# Altium schematic sheet coolaz-sheet.schdoc
size 212 x 144 mm
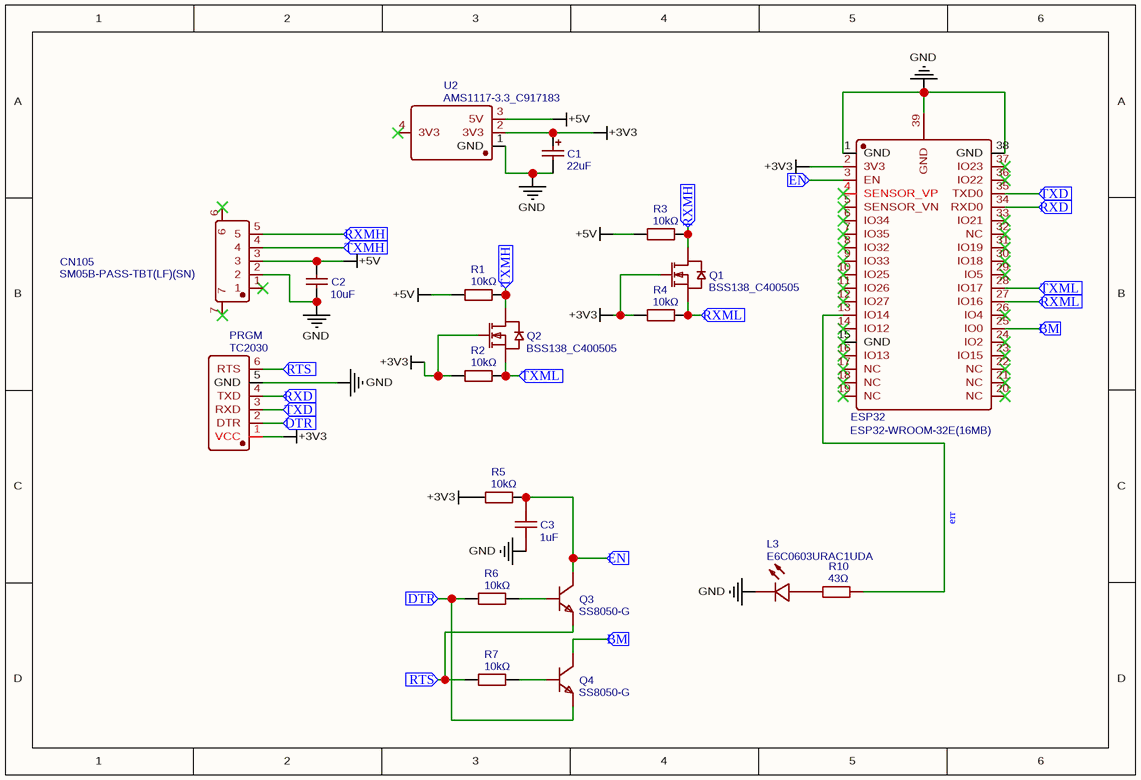
[diagram p0: coolaz-sheet.schdoc]

## Parts
C1  22uF  [CAP-SMD_L3.5-W2.8-R-RD]
C2  10uF  [C0402]
C3  1uF  [C0402]
CN105  SM05B-PASS-TBT(LF)(SN)  [CONN-SMD_5P-P2.00_SM05B-PASS-TBT-LF-SN]
ESP32  ESP32-WROOM-32E(16MB)  [WIFI-SMD_ESP32-WROOM-32E]
L3  E6C0603URAC1UDA  [LED0603-R-RD]
PRGM  TC2030  [TAG-CONNECT_TC2030-IDC-FP]
Q1  BSS138_C400505  [SOT-23-3_L2.9-W1.3-P1.90-LS2.4-BR]
Q2  BSS138_C400505  [SOT-23-3_L2.9-W1.3-P1.90-LS2.4-BR]
Q3  SS8050-G  [SOT-23-3_L2.9-W1.6-P1.90-LS2.8-BR]
Q4  SS8050-G  [SOT-23-3_L2.9-W1.6-P1.90-LS2.8-BR]
R1  10kΩ  [R0603]
R2  10kΩ  [R0603]
R3  10kΩ  [R0603]
R4  10kΩ  [R0603]
R5  10kΩ  [R0603]
R6  10kΩ  [R0603]
R7  10kΩ  [R0603]
R10  43Ω  [R0402]
U2  AMS1117-3.3_C917183  [SOT-223-3_L6.7-W3.7-P2.30-LS7.0-BR]

## Ports
BM (in), DTR (in), EN (in), RTS (in), RXD (in), RXMH (in), RXML (in), TXD (in), TXMH (in), TXML (in)

## Nets
+3V3: C1.1 ESP32.2(3V3) PRGM.1(VCC) Q1.1(G) Q2.1(G) R2.1 R4.1 R5.1 U2.2(3V3)
+5V: C2.2 CN105.3 R1.1 R3.1 U2.3(5V)
GND: C1.2 C2.1 C3.1 CN105.2 ESP32.1(GND) ESP32.38(GND) ESP32.39(GND) L3.2(-) PRGM.5(GND) U2.1(GND)
BM: ESP32.25(IO0) Q4.3(C) ; port BM
DTR: PRGM.2(DTR) Q4.2(E) R6.1 ; port DTR
EN: C3.2 ESP32.3(EN) Q3.3(C) R5.2 ; port EN
err: ESP32.13(IO14) R10.2
RTS: PRGM.6(RTS) Q3.2(E) R7.1 ; port RTS
RXD: ESP32.34(RXD0) PRGM.4(TXD) ; port RXD
RXMH: CN105.5 Q1.3(D) R3.2 ; port RXMH
RXML: ESP32.27(IO16) Q1.2(S) R4.2 ; port RXML
TXD: ESP32.35(TXD0) PRGM.3(RXD) ; port TXD
TXMH: CN105.4 Q2.3(D) R1.2 ; port TXMH
TXML: ESP32.28(IO17) Q2.2(S) R2.2 ; port TXML
NetL3_1: L3.1(+) R10.1
NetQ3_1: Q3.1(B) R6.2
NetQ4_1: Q4.1(B) R7.2

Not connected (* = marked no-connect by the designer): CN105 1* 6* 7*; ESP32 4(SENSOR_VP)* 5(SENSOR_VN)* 6(IO34)* 7(IO35)* 8(IO32)* 9(IO33)* 10(IO25)* 11(IO26)* 12(IO27)* 14(IO12)* 15(GND)* 16(IO13)* 17(NC)* 18(NC)* 19(NC)* 20(NC)* 21(NC)* 22(NC)* 23(IO15)* 24(IO2)* 26(IO4)* 29(IO5)* 30(IO18)* 31(IO19)* 32(NC)* 33(IO21)* 36(IO22)* 37(IO23)*; U2 4(3V3)*

## Library data of the parts
C1 = 22uF: BOM_Manufacturer: CEC; BOM_Manufacturer Part: CA45-B-16V-22UF-K; nameAlias: Capacitance; BOM_Supplier: LCSC; BOM_Supplier Part: C129568; BOM_JLCPCB Part Class: Extended Part; spicePre: C; spiceSymbolName: CA45-B-16V-22UF-K
C2 = 10uF: BOM_Manufacturer Part: CL05A106MQ5NUNC; BOM_Manufacturer: SAMSUNG; nameAlias: Capacitance; BOM_Supplier: LCSC; BOM_Supplier Part: C15525; BOM_JLCPCB Part Class: Basic Part; spicePre: C; spiceSymbolName: CL05A106MQ5NUNC
C3 = 1uF: BOM_Manufacturer: SAMSUNG; BOM_Manufacturer Part: CL05A105KA5NQNC; nameAlias: Capacitance; BOM_Supplier: LCSC; BOM_Supplier Part: C52923; BOM_JLCPCB Part Class: Basic Part; spicePre: C; spiceSymbolName: CL05A105KA5NQNC
CN105 = SM05B-PASS-TBT(LF)(SN): BOM_Manufacturer: JST Sales America; Contributor: LCSC; BOM_Supplier: LCSC; BOM_Supplier Part: C485350; BOM_Manufacturer Part: SM05B-PASS-TBT(LF)(SN); BOM_JLCPCB Part Class: Extended Part; spicePre: C; spiceSymbolName: SM05B-PASS-TBT(LF)(SN)
ESP32 = ESP32-WROOM-32E(16MB): BOM_Manufacturer: Espressif Systems; Contributor: LCSC; BOM_Supplier: LCSC; BOM_Supplier Part: C701343; BOM_Manufacturer Part: ESP32-WROOM-32E(16MB); BOM_JLCPCB Part Class: Extended Part; spicePre: U; spiceSymbolName: ESP32-WROOM-32E(16MB)
L3 = E6C0603URAC1UDA: BOM_Manufacturer: EKINGLUX; Contributor: LCSC; BOM_Supplier: LCSC; BOM_Supplier Part: C375444; BOM_Manufacturer Part: E6C0603URAC1UDA; BOM_JLCPCB Part Class: Extended Part; spicePre: L; spiceSymbolName: E6C0603URAC1UDA
PRGM = TC2030: BOM_Manufacturer: TagConnect; BOM_Manufacturer Part: TC2030-FTDI-C232HD-DDHSP-0-DTR; Contributor: thomas_1863; BOM_Supplier: Tag Connect; BOM_Supplier Part: TC2030-FTDI-C232HD-DDHSP-0-DTR; link: https://www.tag-connect.com/product/tc2030-ftdi-c232hd-ddhsp-0-dtr; spicePre: U; spiceSymbolName: TC2030
Q1 Q2 = BSS138_C400505: BOM_Manufacturer: Yangzhou Yangjie Elec Tech; BOM_Manufacturer Part: BSS138; Contributor: LCSC; BOM_Supplier: LCSC; BOM_Supplier Part: C400505; BOM_JLCPCB Part Class: Extended Part; spicePre: Q; spiceSymbolName: BSS138_C400505
Q3 Q4 = SS8050-G: BOM_Manufacturer: CJ; Contributor: LCSC; BOM_Supplier: LCSC; BOM_Manufacturer Part: SS8050-G; BOM_Supplier Part: C164886; BOM_JLCPCB Part Class: Extended Part; spicePre: Q; spiceSymbolName: SS8050-G
R1-R7 = 10kΩ: BOM_Manufacturer: UniOhm; BOM_Manufacturer Part: 0603WAF1002T5E; nameAlias: Resistance; Resistance (Ohms): 10K; BOM_Supplier: LCSC; BOM_Supplier Part: C25804; BOM_JLCPCB Part Class: Basic Part; spicePre: R; spiceSymbolName: 0603WAF1002T5E
R10 = 43Ω: BOM_Manufacturer: Uniroyal Elec; BOM_Manufacturer Part: 0402WGF430JTCE; Resistance (Ohms): 43; nameAlias: Resistance; Contributor: LCSC; BOM_Supplier: LCSC; BOM_Supplier Part: C270600; BOM_JLCPCB Part Class: Extended Part; spicePre: R; spiceSymbolName: 0402WGF430JTCE
U2 = AMS1117-3.3_C917183: BOM_Manufacturer: JSMSEMI; Contributor: LCSC; BOM_Supplier: LCSC; BOM_Supplier Part: C917183; BOM_Manufacturer Part: AMS1117-3.3; BOM_JLCPCB Part Class: Extended Part; spicePre: U; spiceSymbolName: AMS1117-3.3_C917183